# Altium schematic sheet Top.SchDoc
size A4
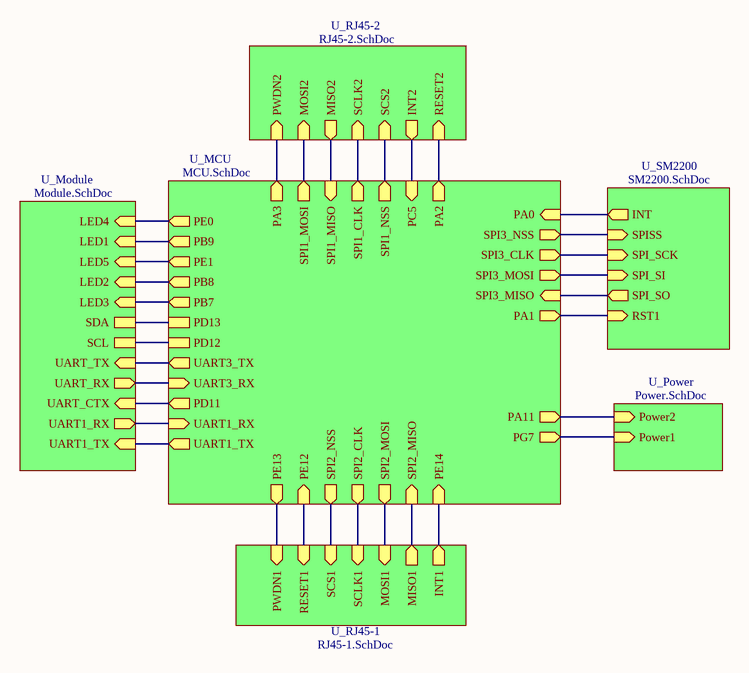
[diagram p0: Top.SchDoc]

## Sub-sheets
U_MCU = MCU.SchDoc: SPI1_NSS (out), SPI1_CLK (out), SPI1_MISO (in), SPI1_MOSI (out), SPI2_NSS (out), SPI2_CLK (out), SPI2_MISO (in), SPI2_MOSI (out), PA3 (out), PC5 (in), PE14 (in), PE13 (out), PE12 (in), PA2 (out), PA1 (out), PA0 (in), UART1_TX (out), UART1_RX (in), UART3_TX (out), UART3_RX (in), PD11 (out), PD13, PD12, PG7 (out), PA11 (out), PE1 (out), PE0 (out), PB9 (out), PB8 (out), PB7 (out), SPI3_CLK (out), SPI3_MOSI (out), SPI3_NSS (out), SPI3_MISO (in)
U_Module = Module.SchDoc: UART_RX (out), UART_TX (in), UART_CTX (in), SCL, SDA, UART1_TX (in), UART1_RX (out), LED1 (in), LED2 (in), LED3 (in), LED4 (in), LED5 (in)
U_Power = Power.SchDoc: Power1 (in), Power2 (in)
U_RJ45-1 = RJ45-1.SchDoc: INT1 (out), SCS1 (in), SCLK1 (in), MOSI1 (in), MISO1 (out), PWDN1 (in), RESET1 (in)
U_RJ45-2 = RJ45-2.SchDoc: INT2 (out), SCS2 (in), SCLK2 (in), MOSI2 (in), MISO2 (out), PWDN2 (in), RESET2 (in)
U_SM2200 = SM2200.SchDoc: SPISS (in), SPI_SCK (in), SPI_SI (in), SPI_SO (out), RST1 (in), INT (out)

## Nets
(unnamed): sheet U_MCU/SPI1_NSS, sheet U_RJ45-2/SCS2
(unnamed): sheet U_MCU/SPI1_CLK, sheet U_RJ45-2/SCLK2
(unnamed): sheet U_MCU/SPI1_MISO, sheet U_RJ45-2/MISO2
(unnamed): sheet U_MCU/SPI1_MOSI, sheet U_RJ45-2/MOSI2
(unnamed): sheet U_MCU/SPI2_NSS, sheet U_RJ45-1/SCS1
(unnamed): sheet U_MCU/SPI2_CLK, sheet U_RJ45-1/SCLK1
(unnamed): sheet U_MCU/SPI2_MISO, sheet U_RJ45-1/MISO1
(unnamed): sheet U_MCU/SPI2_MOSI, sheet U_RJ45-1/MOSI1
(unnamed): sheet U_MCU/PA3, sheet U_RJ45-2/PWDN2
(unnamed): sheet U_MCU/PC5, sheet U_RJ45-2/INT2
(unnamed): sheet U_MCU/PE14, sheet U_RJ45-1/INT1
(unnamed): sheet U_MCU/PE13, sheet U_RJ45-1/PWDN1
(unnamed): sheet U_MCU/PE12, sheet U_RJ45-1/RESET1
(unnamed): sheet U_MCU/PA2, sheet U_RJ45-2/RESET2
(unnamed): sheet U_MCU/PA1, sheet U_SM2200/RST1
(unnamed): sheet U_MCU/PA0, sheet U_SM2200/INT
(unnamed): sheet U_MCU/UART1_TX, sheet U_Module/UART1_TX
(unnamed): sheet U_MCU/UART1_RX, sheet U_Module/UART1_RX
(unnamed): sheet U_MCU/UART3_TX, sheet U_Module/UART_TX
(unnamed): sheet U_MCU/UART3_RX, sheet U_Module/UART_RX
(unnamed): sheet U_MCU/PD11, sheet U_Module/UART_CTX
(unnamed): sheet U_MCU/PD13, sheet U_Module/SDA
(unnamed): sheet U_MCU/PD12, sheet U_Module/SCL
(unnamed): sheet U_MCU/PG7, sheet U_Power/Power1
(unnamed): sheet U_MCU/PA11, sheet U_Power/Power2
(unnamed): sheet U_MCU/PE1, sheet U_Module/LED5
(unnamed): sheet U_MCU/PE0, sheet U_Module/LED4
(unnamed): sheet U_MCU/PB9, sheet U_Module/LED1
(unnamed): sheet U_MCU/PB8, sheet U_Module/LED2
(unnamed): sheet U_MCU/PB7, sheet U_Module/LED3
(unnamed): sheet U_MCU/SPI3_CLK, sheet U_SM2200/SPI_SCK
(unnamed): sheet U_MCU/SPI3_MOSI, sheet U_SM2200/SPI_SI
(unnamed): sheet U_MCU/SPI3_NSS, sheet U_SM2200/SPISS
(unnamed): sheet U_MCU/SPI3_MISO, sheet U_SM2200/SPI_SO